# Altium schematic sheet CAN.SchDoc
size A4; SheetNumber: 7; SheetTotal: 15
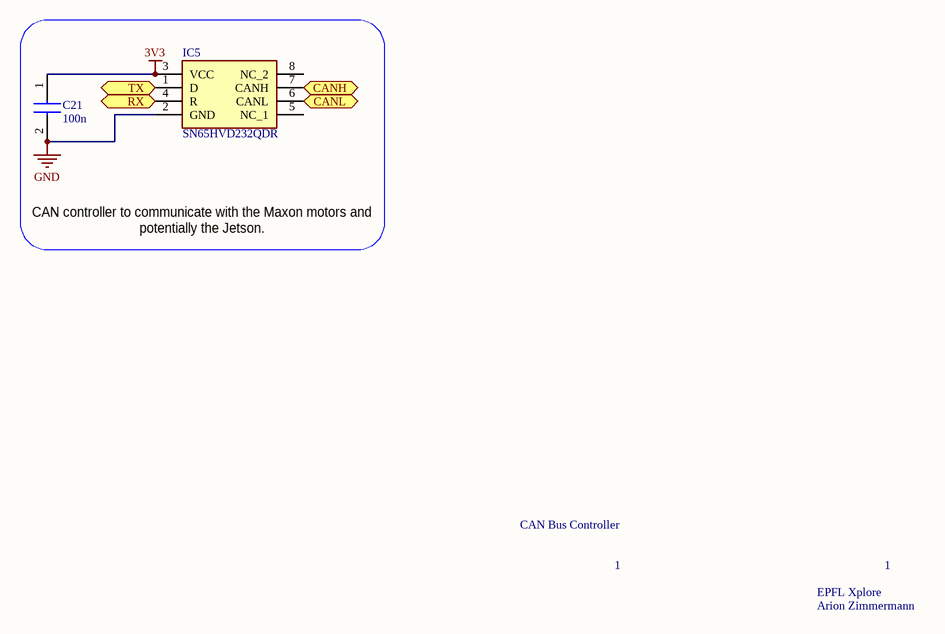
[diagram p0: CAN.SchDoc]

## Parts
C21  value 100n  [CAPC1608X95N]  (hidden comment: C0603C104K5RACTU)
IC5  SN65HVD232QDR  [SOIC127P600X175-8N]

## Ports
CANH (bidir), CANL (bidir), RX (bidir), TX (bidir)

## Nets
3V3: C21.1 IC5.3(VCC)
GND: C21.2 IC5.2(GND)
CANH: IC5.7(CANH) ; port CANH
CANL: IC5.6(CANL) ; port CANL
RX: IC5.4(R) ; port RX
TX: IC5.1(D) ; port TX

Not connected (* = marked no-connect by the designer): IC5 5(NC_1) 8(NC_2)

## Notes on the sheet
- CAN controller to communicate with the Maxon motors and potentially the Jetson.
- CAN Bus Controller
- 1
- EPFL Xplore
- Arion Zimmermann

## Library data of the parts
C21 = C0603C104K5RACTU: Capacitor; Manufacturer_Name: Kemet; Datasheet Link: http://www.farnell.com/datasheets/2205446.pdf; Height: 0.95mm; Manufacturer_Part_Number: C0603C104K5RACTU; Mouser Part Number: 80-C0603C104K5R; Mouser Price/Stock: https://www.mouser.co.uk/ProductDetail/KEMET/C0603C104K5RACTU?qs=l5k%252BbMnNDkkVcnZPSAaaiQ%3D%3D; Arrow Part Number: C0603C104K5RACTU; Arrow Price/Stock: https://www.arrow.com/en/products/c0603c104k5ractu/kemet-corporation; Supplier 1: Mouser; Supplier Part Number 1: 80-C0603C104K5R
IC5 = SN65HVD232QDR: Integrated Circuit; Manufacturer_Name: Texas Instruments; Datasheet Link: http://www.ti.com/lit/gpn/SN65HVD232Q; Height: 1.75mm; Manufacturer_Part_Number: SN65HVD232QDR; Mouser Part Number: 595-SN65HVD232QDR; Mouser Price/Stock: https://www.mouser.co.uk/ProductDetail/Texas-Instruments/SN65HVD232QDR?qs=QViXGNcIEAuDpfsGPShang%3D%3D; Arrow Part Number: SN65HVD232QDR; Arrow Price/Stock: https://www.arrow.com/en/products/sn65hvd232qdr/texas-instruments?region=nac